# EAGLE design ACDC (EAGLE 9.6.2)
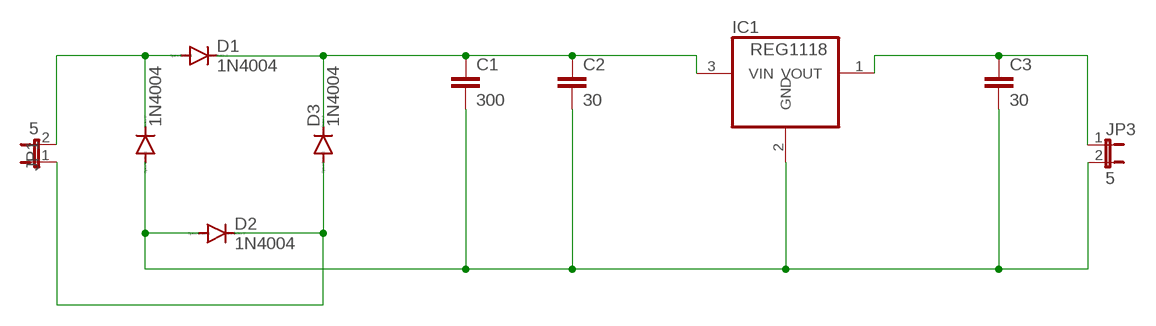
[diagram p0: schematic, sheet 1]

## Parts
C1  300  C2,5-3  [C2.5-3]
C2  30  C2,5-3  [C2.5-3]
C3  30  C2,5-3  [C2.5-3]
D1  1N4004  [DO41-10]
D2  1N4004  [DO41-10]
D3  1N4004  [DO41-10]
D4  1N4004  [DO41-10]
IC1  REG1118  [SOT223]
JP1  5  JP1E  [JP1]
JP3  5  JP1E  [JP1]

## Nets
N$1: D1.A D4.C JP1.2
N$2: C1.1 C2.1 D1.C D3.C IC1.3(VIN)
N$3: D2.C D3.A JP1.1
N$4: C1.2 C2.2 C3.2 D2.A D4.A IC1.2(GND) JP3.2
N$5: C3.1 IC1.1(VOUT) JP3.1

## Library data of the parts
C1-C3 = capacitor-wima:C: CAPACITOR naming: grid - package width
D1-D4 = diode:1N4004: DIODE general purpose rectifier, 1 A
IC1 = burr-brown:REG1118: 800mA Low Dropout (LDO) Positive Regulator with Current Source and Sink Capability; MPN: REG1118-2.85/2K5G4; OC_FARNELL: unknown; OC_NEWARK: 14M2185
JP1 JP3 = jumper:JP1E: JUMPER

## Board
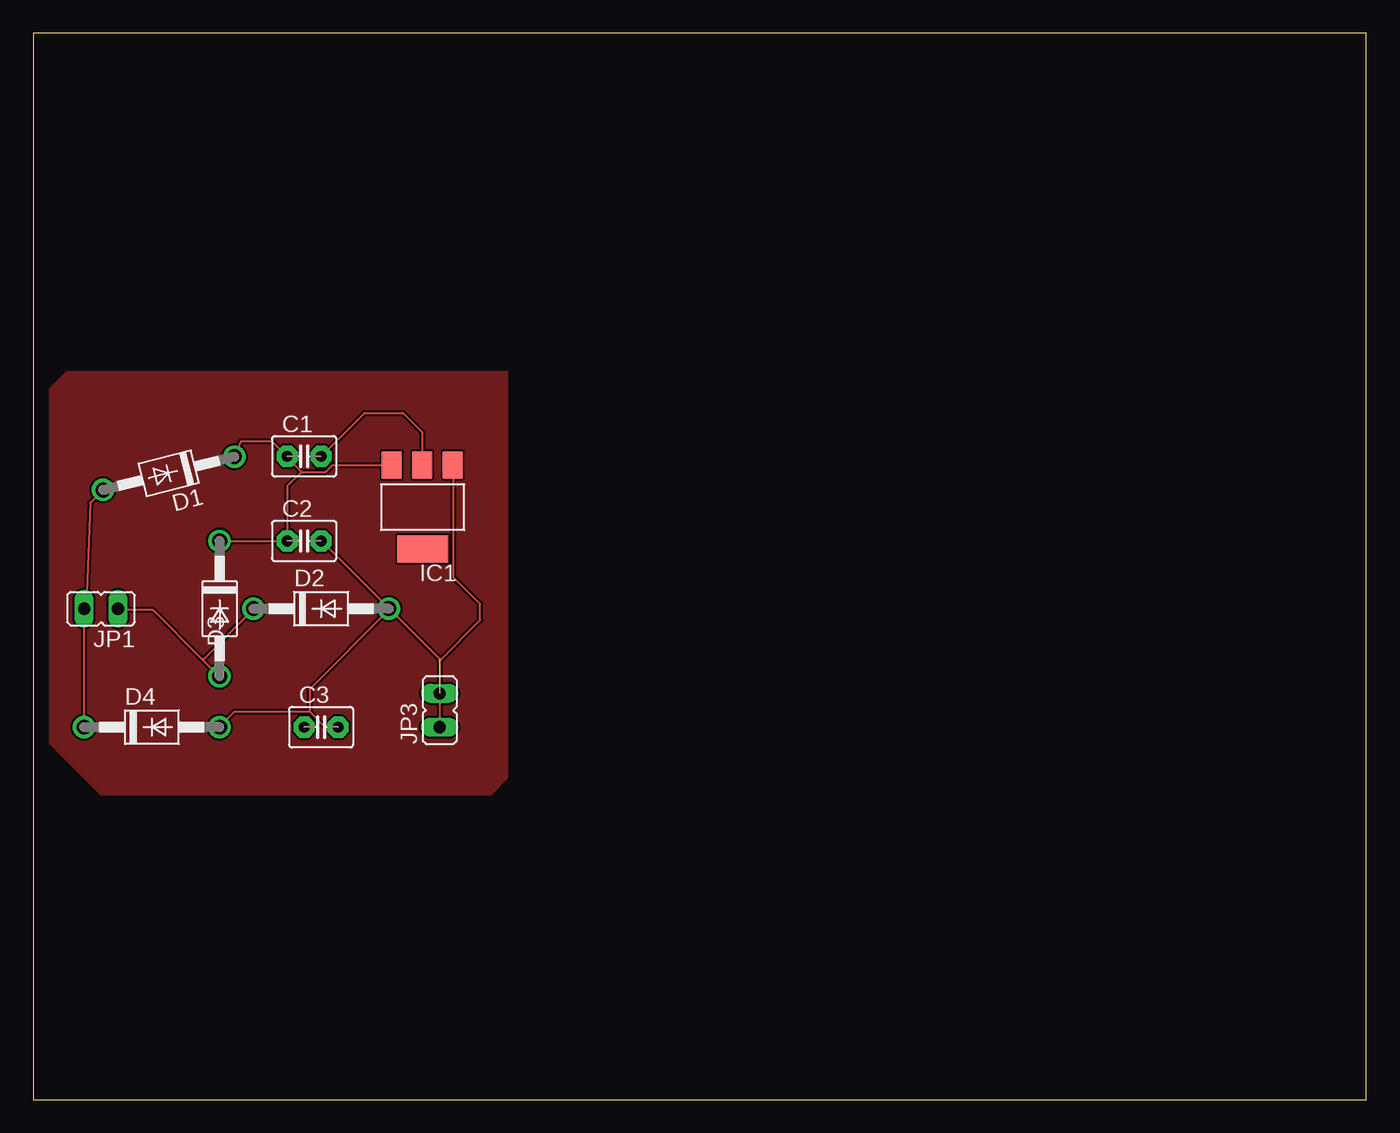
[diagram p1: board, top side]
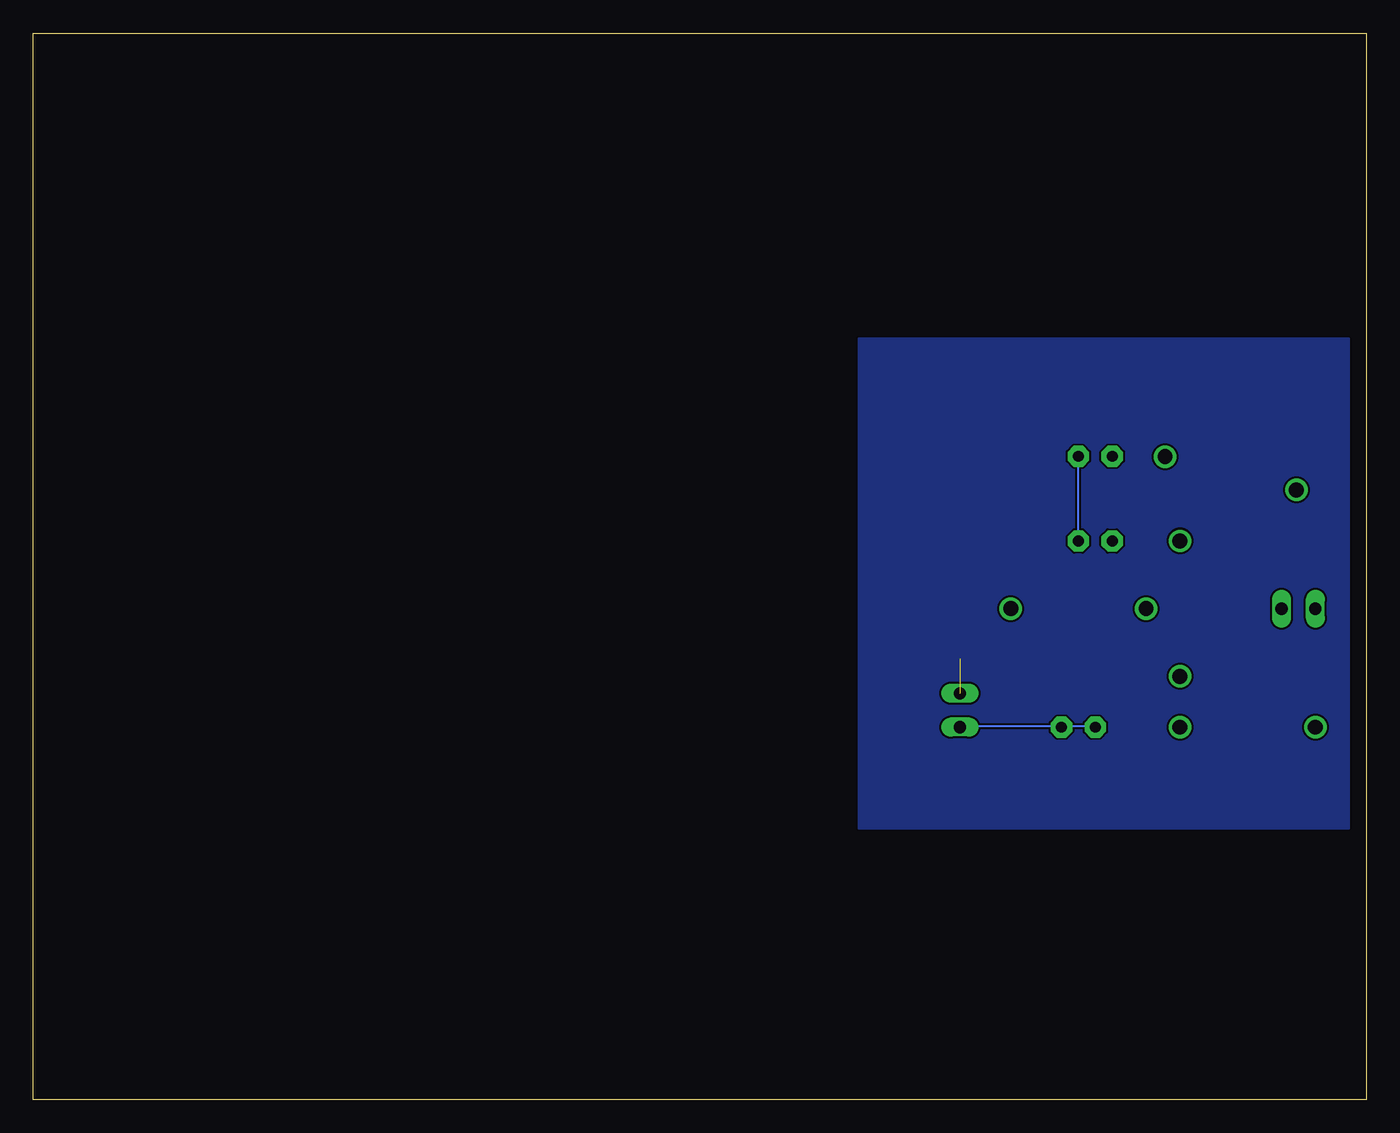
[diagram p2: board, bottom side, seen from below]

Size 100 x 80 mm. Coordinates in mm from the lower left corner, seen from the top.
Outline: 0,0 100,0 100,80 0,80 0,0
Copper layers (1*16): Top 0.035mm / dielectric 1.5mm / Bottom 0.035mm
Design rules "default": minimum track width 6mil, minimum drill 0.35mm, track to track 6mil, track to pad 6mil, pad to pad 6mil, via to via 6mil, smd to smd 6mil, copper to edge 40mil, drill to drill 6mil, minimum pad ring 10mil, minimum via ring 8mil, stop-mask expansion 4mil, vias tented up to drill 0mil, thermal gap 10mil

### Footprints (pad centres in the part's own frame; a part is rotated, then mirrored left to right if it is on the bottom)
C2.5-3 = drill 0.813 pad 1.6 octagon: 1 -1.27,0; 2 1.27,0
DO41-10 = drill 1.118: A 5.08,0; C -5.08,0
SOT223 = smd 1.499 x 2.007: 1 -2.261,-3.15; 2 0.025,-3.15; 3 2.311,-3.15 | smd 3.81 x 2.007: 4 0,3.15
JP1 = drill 0.914 long: 1 0,-1.27; 2 0,1.27

### Placement (x,y rotation side)
C1  20.32,48.26 0 top
C2  20.32,41.91 0 top
C3  21.59,27.94 0 top
D1  10.16,46.99 194.2 top
D2  21.59,36.83 0 top
D3  13.97,36.83 270 top
D4  8.89,27.94 0 top
IC1  29.21,44.45 180 top
JP1  5.08,36.83 90 top
JP3  30.48,29.21 0 top

### Tracks (layer width: path | path; a pad name or v marks a point on that pad's centre or on a via)
ACDC
  pour Top: 2.54,54.61 35.56,54.61 35.56,24.13 34.29,22.86 5.08,22.86 1.27,26.67 1.27,53.34
  pour Bottom: 2.54,57.15 38.1,57.15 38.1,39.37 38.1,20.32 1.27,20.32 1.27,57.15
N$1
  Top 0.152: D4.C JP1.2 3.81,36.88 3.96,37.03 4.25,44.76 D1.A
N$2
  Top 0.152: D3.C C2.1 19.05,46.02 20.12,47.09 | IC1.3 22.45,47.6 21.95,47.09 20.12,47.09 | 20.12,47.09 19.05,48.16 C1.1 17.93,49.38 15.56,49.38 D1.C
N$3
  Top 0.152: D3.A 12.65,33.07 | 12.65,33.07 8.99,36.73 6.4,36.73 JP1.1 | 12.65,33.07 12.8,33.07 16.46,36.73 D2.C
N$4  (1 unrouted)
  Top 0.152: 20.73,29.11 21.79,28.04 22.86,28.04 C3.2 | 20.73,29.11 15.09,29.11 14.02,28.04 D4.A | 30.48,33.07 26.67,36.88 | C1.2 24.84,51.51 27.74,51.51 29.18,50.06 IC1.2 | 26.67,36.88 21.64,41.91 C2.2 | 26.67,36.88 D2.A 26.67,36.73 20.73,30.79 20.73,29.11
  Bottom 0.152: C2.2 21.64,41.91 21.64,48.16 C1.2
N$5
  Top 0.152: IC1.1 31.55,47.6 31.55,39.17 33.53,37.19 33.53,35.97 30.48,32.92 JP3.1
  Bottom 0.152: JP3.1 30.38,28.04 20.42,28.04 C3.1